# EAGLE schematic power-18 (EAGLE 6.4)
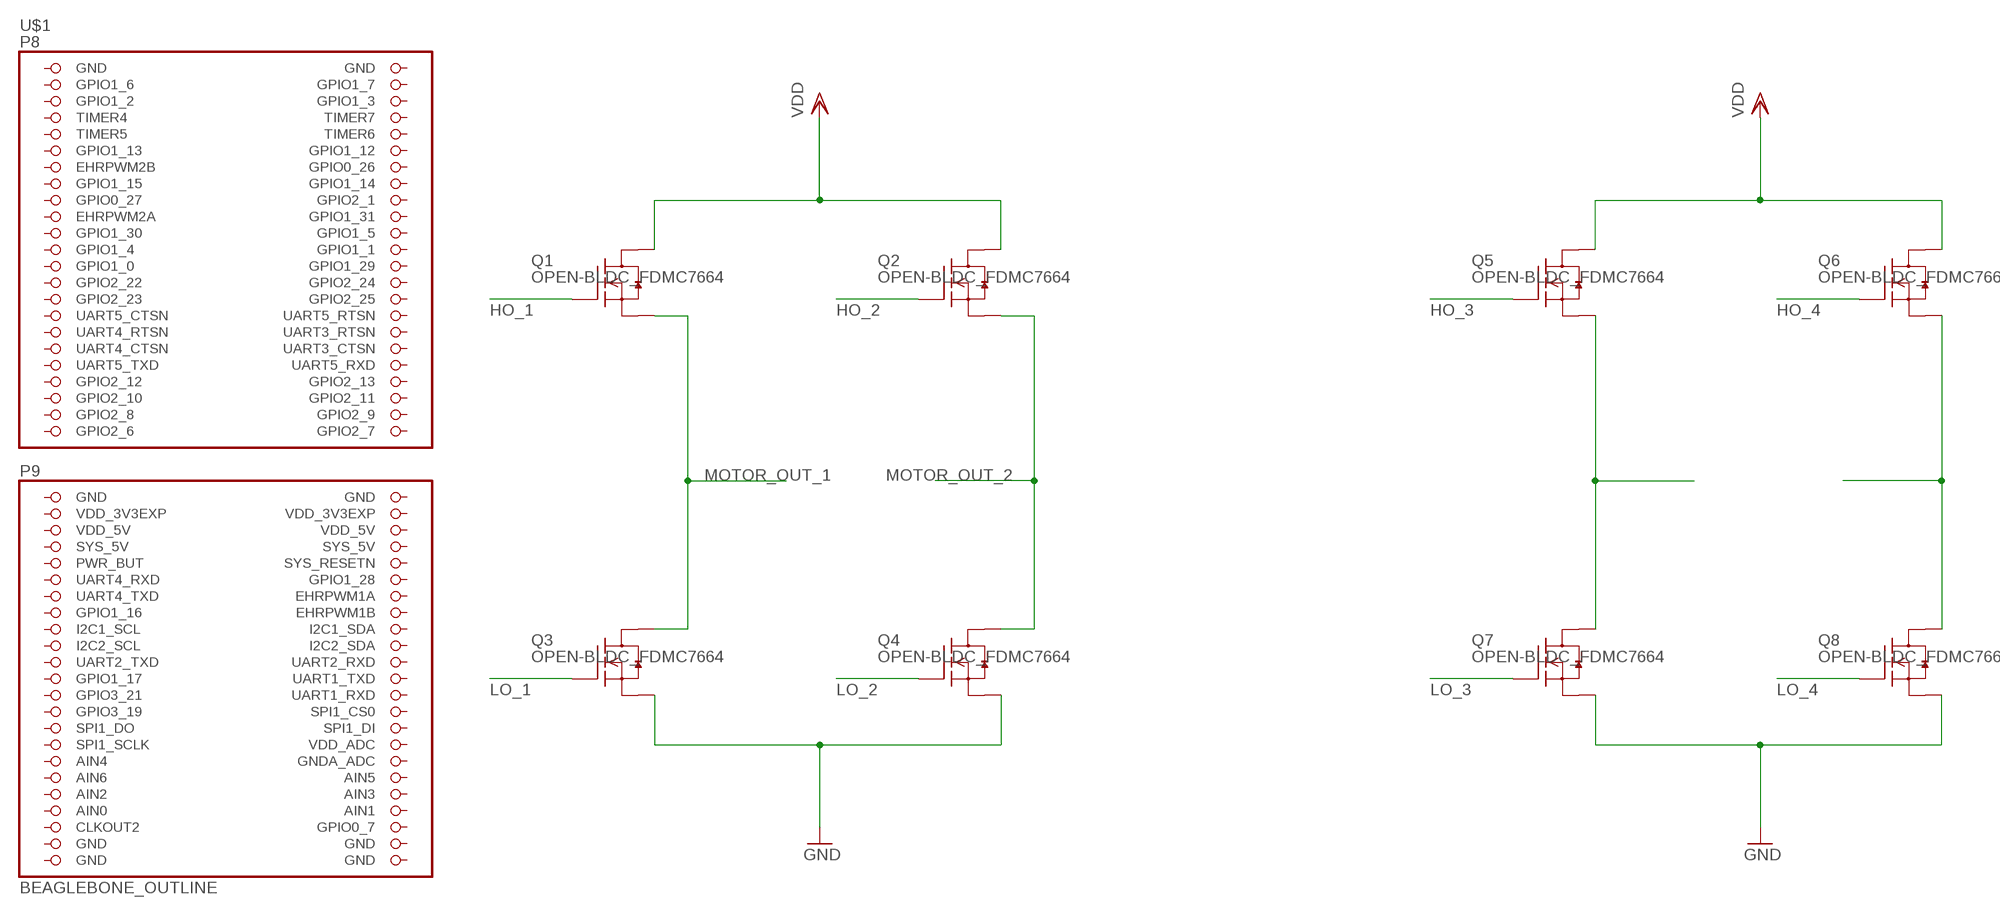
[diagram p0: schematic, sheet 1]

## Parts
Q1  OPEN-BLDC_FDMC7664  [OPEN-BLDC_MLP33]
Q2  OPEN-BLDC_FDMC7664  [OPEN-BLDC_MLP33]
Q3  OPEN-BLDC_FDMC7664  [OPEN-BLDC_MLP33]
Q4  OPEN-BLDC_FDMC7664  [OPEN-BLDC_MLP33]
Q5  OPEN-BLDC_FDMC7664  [OPEN-BLDC_MLP33]
Q6  OPEN-BLDC_FDMC7664  [OPEN-BLDC_MLP33]
Q7  OPEN-BLDC_FDMC7664  [OPEN-BLDC_MLP33]
Q8  OPEN-BLDC_FDMC7664  [OPEN-BLDC_MLP33]
U$1  BEAGLEBONE_OUTLINE  [BEAGLEBONE_SHIELD]

## Nets
GND: Q3.123S(S) Q4.123S(S) Q7.123S(S) Q8.123S(S)
HO_1: Q1.4G(G)
HO_2: Q2.4G(G)
HO_3: Q5.4G(G)
HO_4: Q6.4G(G)
LO_1: Q3.4G(G)
LO_2: Q4.4G(G)
LO_3: Q7.4G(G)
LO_4: Q8.4G(G)
MOTOR_OUT_1: Q1.123S(S) Q3.5678D(D)
MOTOR_OUT_2: Q2.123S(S) Q4.5678D(D)
N$4: Q6.123S(S) Q8.5678D(D)
N$6: Q5.123S(S) Q7.5678D(D)
VDD: Q1.5678D(D) Q2.5678D(D) Q5.5678D(D) Q6.5678D(D)
Unconnected: U$1.3(GPIO1_6) U$1.4(GPIO1_7) U$1.5(GPIO1_2) U$1.6(GPIO1_3) U$1.7(TIMER4) U$1.8(TIMER7) U$1.9(TIMER5) U$1.10(TIMER6) U$1.11(GPIO1_13) U$1.12(GPIO1_12) U$1.13(EHRPWM2B) U$1.14(GPIO0_26) U$1.15(GPIO1_15) U$1.16(GPIO1_14) U$1.17(GPIO0_27) U$1.18(GPIO2_1) U$1.19(EHRPWM2A) U$1.20(GPIO1_31) U$1.21(GPIO1_30) U$1.22(GPIO1_5) U$1.23(GPIO1_4) U$1.24(GPIO1_1) U$1.25(GPIO1_0) U$1.26(GPIO1_29) U$1.27(GPIO2_22) U$1.28(GPIO2_24) U$1.29(GPIO2_23) U$1.30(GPIO2_25) U$1.31(UART5_CTSN) U$1.32(UART5_RTSN) U$1.33(UART4_RTSN) U$1.34(UART3_RTSN) U$1.35(UART4_CTSN) U$1.36(UART3_CTSN) U$1.37(UART5_TXD) U$1.38(UART5_RXD) U$1.39(GPIO2_12) U$1.40(GPIO2_13) U$1.41(GPIO2_10) U$1.42(GPIO2_11) U$1.43(GPIO2_8) U$1.44(GPIO2_9) U$1.45(GPIO2_6) U$1.46(GPIO2_7) U$1.54(SYS_5V) U$1.55(PWR_BUT) U$1.56(SYS_RESETN) U$1.57(UART4_RXD) U$1.58(GPIO1_28) U$1.59(UART4_TXD) U$1.60(EHRPWM1A) U$1.61(GPIO1_16) U$1.62(EHRPWM1B) U$1.63(I2C1_SCL) U$1.64(I2C1_SDA) U$1.65(I2C2_SCL) U$1.66(I2C2_SDA) U$1.67(UART2_TXD) U$1.68(UART2_RXD) U$1.69(GPIO1_17) U$1.70(UART1_TXD) U$1.71(GPIO3_21) U$1.72(UART1_RXD) U$1.73(GPIO3_19) U$1.74(SPI1_CS0) U$1.75(SPI1_DO) U$1.76(SPI1_DI) U$1.77(SPI1_SCLK) U$1.78(VDD_ADC) U$1.79(AIN4) U$1.80(GNDA_ADC) U$1.81(AIN6) U$1.82(AIN5) U$1.83(AIN2) U$1.84(AIN3) U$1.86(AIN1) U$1.87(CLKOUT2) U$1.88(GPIO0_7)

## Power pins joined to a net without a drawn wire
AIN0: U$1.85(AIN0)
GND: U$1.1(GND) U$1.2(GND) U$1.47(GND) U$1.48(GND) U$1.89(GND) U$1.90(GND) U$1.91(GND) U$1.92(GND)
SYS_5V: U$1.53(SYS_5V)
VDD_3V3EXP: U$1.49(VDD_3V3EXP) U$1.50(VDD_3V3EXP)
VDD_5V: U$1.51(VDD_5V) U$1.52(VDD_5V)

## Library data of the parts
Q1-Q8 = motor_control:OPEN-BLDC_FDMC7664
U$1 = adafruit:BEAGLEBONE_OUTLINE: Should match A3 pinout - but not completely tested